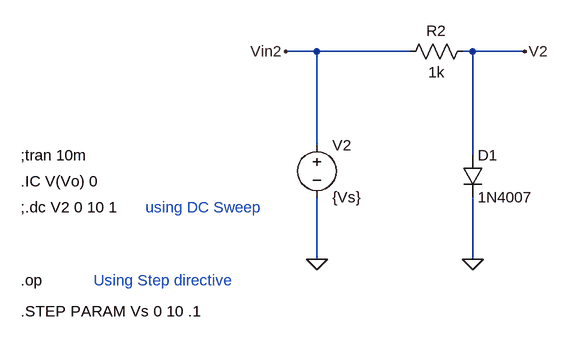
[diagram p0: schematic 03-IVcurves.asc]
03-IVcurves.asc, the LTspice schematic file:
Version 4
SHEET 1 1088 680
WIRE 720 -128 672 -128
WIRE 864 -128 720 -128
WIRE 960 -128 944 -128
WIRE 1040 -128 960 -128
WIRE 720 16 720 -128
WIRE 960 32 960 -128
WIRE 720 192 720 96
WIRE 960 192 960 96
FLAG 960 192 0
FLAG 720 192 0
FLAG 1040 -128 V2
FLAG 672 -128 Vin2
SYMBOL res 960 -144 R90
WINDOW 0 0 56 VBottom 2
WINDOW 3 32 56 VTop 2
SYMATTR InstName R2
SYMATTR Value 1k
SYMBOL voltage 720 0 R0
WINDOW 123 0 0 Left 0
WINDOW 39 0 0 Left 0
SYMATTR InstName V2
SYMATTR Value {Vs}
SYMBOL diode 944 32 R0
SYMATTR InstName D1
SYMATTR Value 1N4007
TEXT 264 32 Left 2 !;tran 10m
TEXT 264 72 Left 2 !.IC V(Vo) 0
TEXT 264 112 Left 2 !;.dc V2 0 10 1
TEXT 264 224 Left 2 !.op
TEXT 264 272 Left 2 !.STEP PARAM Vs 0 10 .1
TEXT 456 112 Left 2 ;using DC Sweep
TEXT 376 224 Left 2 ;Using Step directive

The netlist it stands for:
* 03-IVcurves.asc
R2 V2 Vin2 1k
V2 Vin2 0 {Vs}
D1 V2 0 1N4007
.model D D
.lib standard.dio
;tran 10m
.IC V(Vo) 0
;.dc V2 0 10 1
.op
.STEP PARAM Vs 0 10 .1
* using DC Sweep
* Using Step directive
.backanno
.end